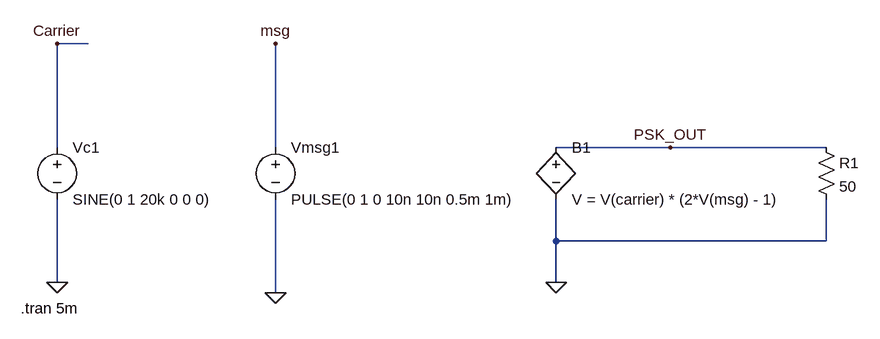
[diagram p0: schematic BPSK (exp 10).asc]
BPSK (exp 10).asc, the LTspice schematic file:
Version 4.1
SHEET 1 1048 680
WIRE -144 -96 -192 -96
WIRE -192 64 -192 -96
WIRE 144 64 144 -96
WIRE 752 64 576 64
WIRE 992 64 752 64
WIRE 576 208 576 144
WIRE 992 208 992 144
WIRE 992 208 576 208
WIRE -192 272 -192 144
WIRE 576 272 576 208
WIRE 144 288 144 144
FLAG -192 272 0
FLAG -192 -96 Carrier
FLAG 144 288 0
FLAG 144 -96 msg
FLAG 576 272 0
FLAG 752 64 PSK_OUT
SYMBOL voltage -192 48 R0
WINDOW 123 0 0 Left 0
WINDOW 39 0 0 Left 0
SYMATTR InstName Vc1
SYMATTR Value SINE(0 1 20k 0 0 0)
SYMBOL voltage 144 48 R0
WINDOW 123 0 0 Left 0
WINDOW 39 0 0 Left 0
SYMATTR InstName Vmsg1
SYMATTR Value PULSE(0 1 0 10n 10n 0.5m 1m)
SYMBOL bv 576 48 R0
SYMATTR InstName B1
SYMATTR Value V = V(carrier) * (2*V(msg) - 1)
SYMBOL res 976 48 R0
SYMATTR InstName R1
SYMATTR Value 50
TEXT -248 312 Left 2 !.tran 5m

The netlist it stands for:
* BPSK (exp 10).asc
Vc1 Carrier 0 SINE(0 1 20k 0 0 0)
Vmsg1 msg 0 PULSE(0 1 0 10n 10n 0.5m 1m)
B1 PSK_OUT 0 V = V(carrier) * (2*V(msg) - 1)
R1 PSK_OUT 0 50
.tran 5m
.backanno
.end